# EasyEDA Pro project 2025新M0板子工程.eprj, board PCB2
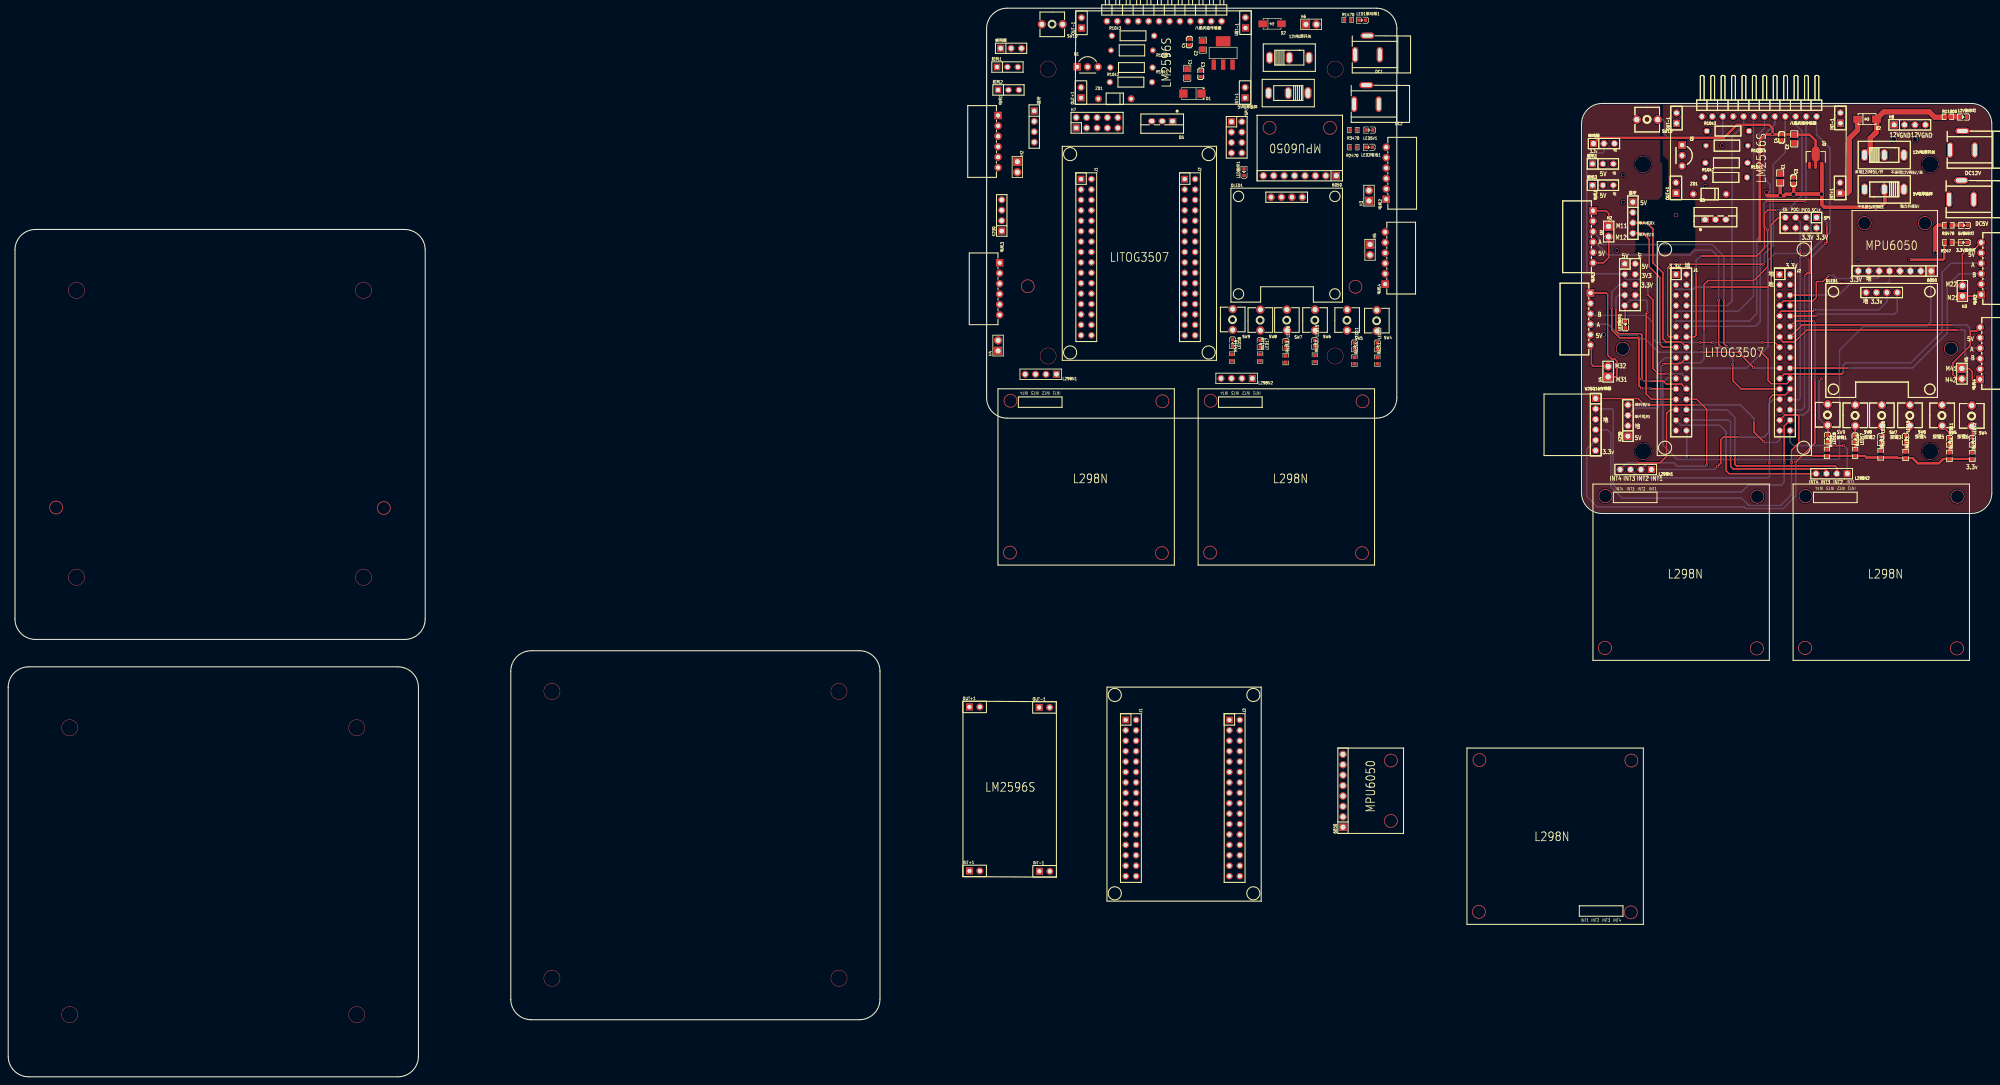
[diagram p3: board, top side]
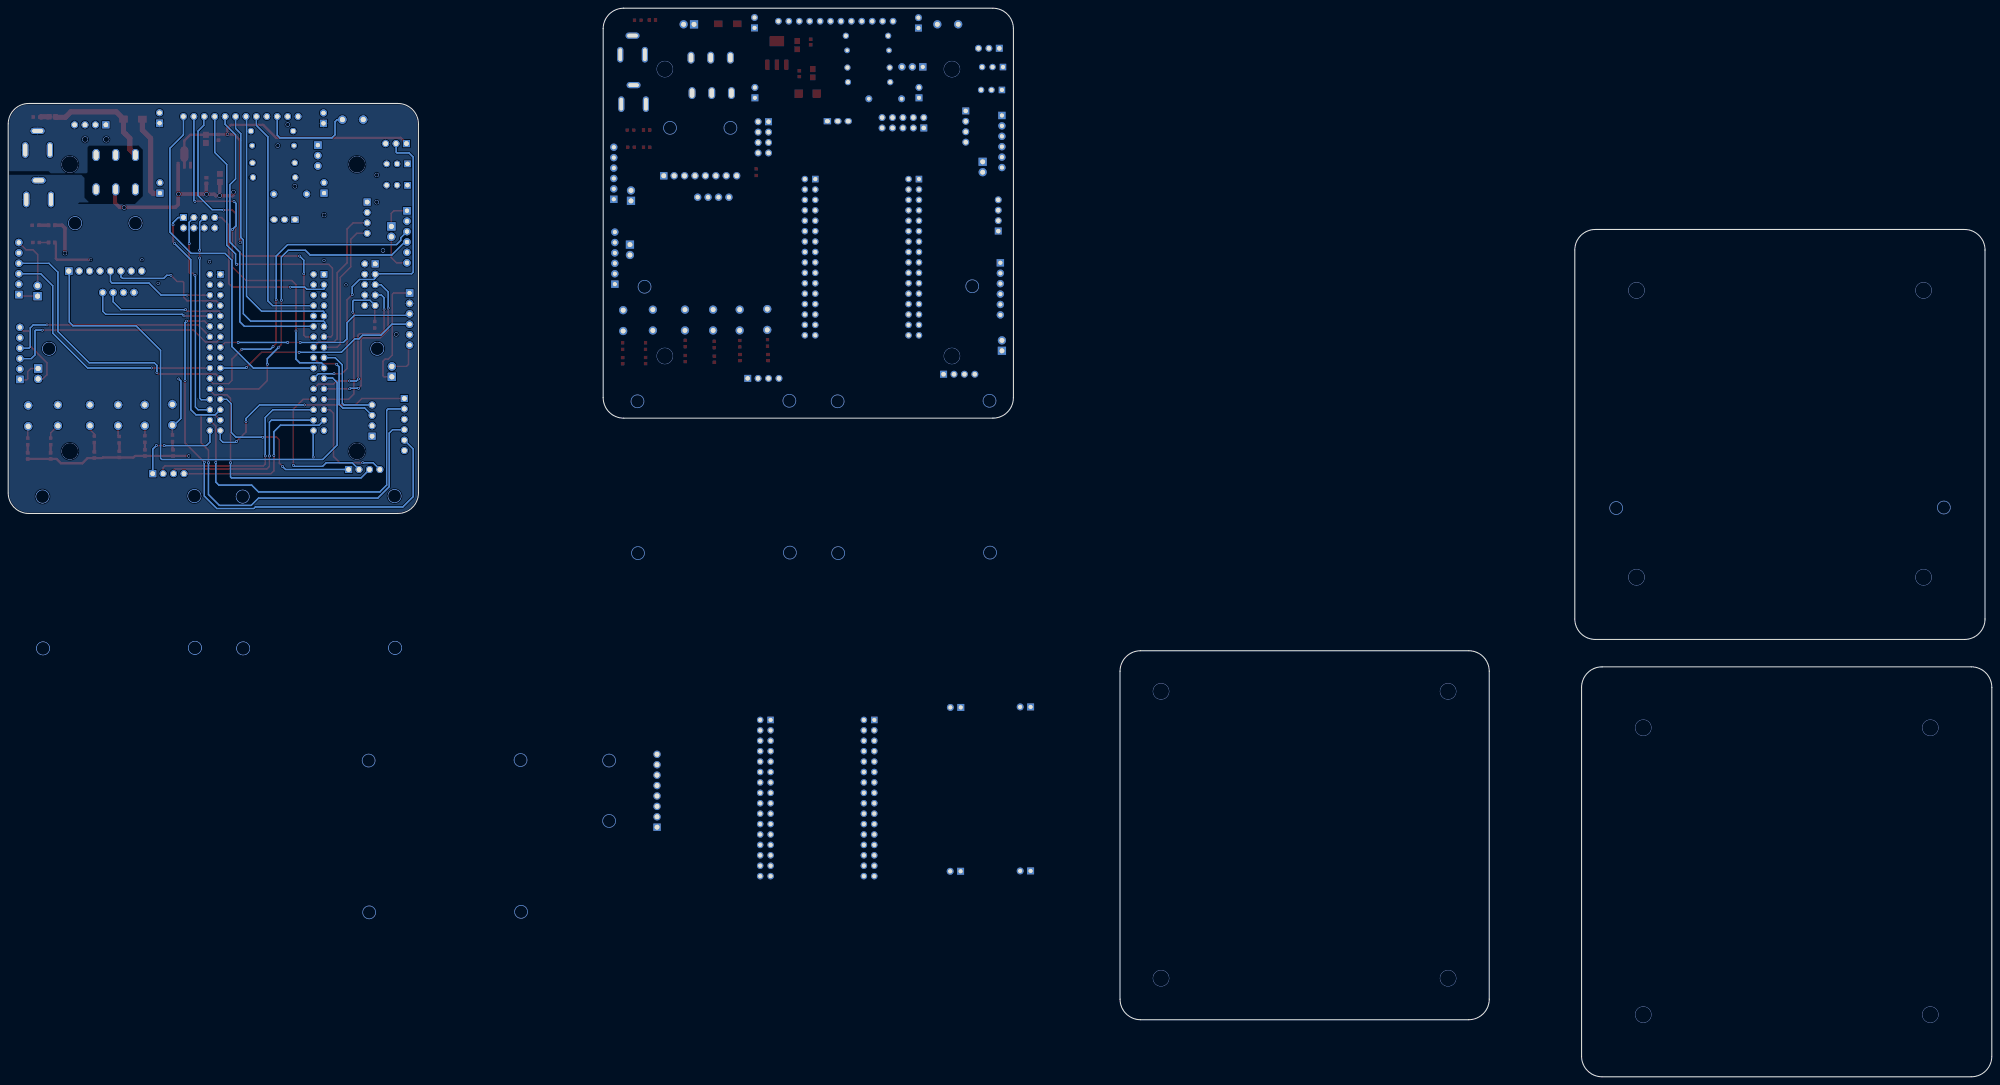
[diagram p4: board, bottom side, seen from below]

Outline 483.54 x 260.66 mm; copper layers: Top Layer, Inner1, Inner2, Bottom Layer. Coordinates in mm from the lower left corner of the outline.
Outline path: 0,95 0,5 arc(1.46,1.46) 5,0 95,0 arc(98.54,1.46) 100,5 100,95 arc(98.54,98.54) 95,100 5,100 arc(1.46,98.54) 0,95 ; 1.65,201.68 1.65,111.68 arc(3.12,108.14) 6.65,106.68 96.65,106.68 arc(100.19,108.14) 101.65,111.68 101.65,201.68 arc(100.19,205.22) 96.65,206.68 6.65,206.68 arc(3.12,205.22) 1.65,201.68 ; 122.51,98.92 122.51,18.92 arc(123.97,15.39) 127.51,13.92 207.51,13.92 arc(211.05,15.39) 212.51,18.92 212.51,98.92 arc(211.05,102.46) 207.51,103.92 127.51,103.92 arc(123.97,102.46) 122.51,98.92 ; 238.51,255.66 238.51,165.66 arc(239.97,162.12) 243.51,160.66 333.51,160.66 arc(337.04,162.12) 338.51,165.66 338.51,255.66 arc(337.04,259.19) 333.51,260.66 243.51,260.66 arc(239.97,259.19) 238.51,255.66 ; 383.54,232.41 383.54,142.41 arc(385,138.88) 388.54,137.41 478.54,137.41 arc(482.08,138.88) 483.54,142.41 483.54,232.41 arc(482.08,235.95) 478.54,237.41 388.54,237.41 arc(385,235.95) 383.54,232.41
Stack: Top Layer 0.035mm / Dielectric1 1.51mm FR4 er 4.5 / Inner1 0.035mm / Dielectric2 0.48mm PP er 4.5 / Inner2 0.035mm / Dielectric3 0.48mm PP er 4.5 / Bottom Layer 0.035mm

## Design rules (mm)
template: JLCPCB Capability(Two Layers Board)
spacing copperThickness1oz (default): track to track 0.102, other pairs 0.152 to 0.3
spacing copperThickness2oz: track to track 0.203, other pairs 0.152 to 0.3
track width copperThickness1oz (default): min 0.127, default 0.254, max 2.54
track width copperThickness2oz: min 0.203, default 0.254, max 2.54
differential pair differentialPair (default): width min 0.127, default 0.254, max 2.54; gap min 0.152, default 0.152
via viaSize (default): diameter min 0.5, default 0.61, max 10; hole min 0.3, default 0.305, max 6.3

## Placement (name value [footprint] x y rotation side)
3.3V指示灯  -  [LED0603-RD-YELLOW]  476.76 203.51 180 top
3.3V指示灯#2  -  [LED0603-RD-YELLOW]  476.76 203.51 180 top
5V指示灯  -  [LED0603-RD-YELLOW]  476.88 207.7 180 top
5V指示灯#2  -  [LED0603-RD-YELLOW]  476.88 207.7 180 top
5V电源选择  -  [SW-TH_SHOU-HAN_SS12D10G4]  312.04 239.95 180 top
5V电源选择#2  -  [SW-TH_SHOU-HAN_SS12D10G4]  457.33 216.46 180 top
5V电源选择#3  -  [SW-TH_SHOU-HAN_SS12D10G4]  457.33 216.46 180 top
12V指示灯  -  [LED0603-RD-YELLOW]  476.63 234.11 180 top
12V指示灯#2  -  [LED0603-RD-YELLOW]  476.63 234.11 180 top
12V电源开关  -  [SW-TH_SHOU-HAN_SS12D10G4]  312.29 248.59 0 top
12V电源开关#2  -  [SW-TH_SHOU-HAN_SS12D10G4]  457.33 224.84 0 top
12V电源开关#3  -  [SW-TH_SHOU-HAN_SS12D10G4]  457.33 224.84 0 top
6050  -  [HDR-TH_8P-P2.54-V-F-1]  459.88 196.54 180 top
6050#2  -  [HDR-TH_8P-P2.54-V-F-1]  314.85 219.79 180 top
6050#3  -  [HDR-TH_8P-P2.54-V-F-1]  459.88 196.54 180 top
6050#4  -  [HDR-TH_8P-P2.54-V-F-1]  325.37 69.77 90 top
C1  -  [C0805]  287.4 244.78 270 top
C1#2  -  [C0805]  431.93 219.25 270 top
C1#3  -  [C0805]  431.93 219.25 270 top
C2  -  [C0805]  291.21 251.64 90 top
C2#2  -  [C0805]  435.36 228.78 90 top
C2#3  -  [C0805]  435.36 228.78 90 top
C3  -  [C0603]  290.7 244.65 270 top
C3#2  -  [C0603]  435.23 218.62 270 top
C3#3  -  [C0603]  435.23 218.62 270 top
C4  -  [C0603]  287.91 252.4 90 top
C4#2  -  [C0603]  432.31 229.16 90 top
C4#3  -  [C0603]  432.31 229.16 90 top
D1  SS34  [SMA_L4.3-W2.6-LS5.2-RD]  288.67 239.83 180 top
D2  -  [SMA_L4.3-W2.6-LS5.0-FD]  308.1 256.85 180 top
D2#2  -  [SMA_L4.3-W2.6-LS5.0-FD]  453.14 233.6 180 top
D2#3  -  [SMA_L4.3-W2.6-LS5.0-FD]  453.14 233.6 180 top
DC1  DC005-T25  [DC-IN-TH_DC-005-20A-1]  331.34 251.64 180 top
DC2  DC005-T25  [DC-IN-TH_DC-005-20A-1]  331.09 239.57 180 top
DC5V  -  [DC-IN-TH_DC-005-20A-1]  476.12 216.33 180 top
DC5V#2  -  [DC-IN-TH_DC-005-20A-1]  476.12 216.33 180 top
DC12V  -  [DC-IN-TH_DC-005-20A-1]  476.38 228.4 180 top
DC12V#2  -  [DC-IN-TH_DC-005-20A-1]  476.38 228.4 180 top
H2  -  [HDR-TH_2P-P2.54-V-M]  246 221.92 270 top
H2#2  -  [HDR-TH_2P-P2.54-V-M]  390.14 206.17 270 top
H2#3  -  [HDR-TH_2P-P2.54-V-M]  390.14 206.17 270 top
H3  -  [HDR-TH_2P-P2.54-V-M]  331.72 214.94 90 top
H3#2  -  [HDR-TH_2P-P2.54-V-M]  476.38 191.69 90 top
H3#3  -  [HDR-TH_2P-P2.54-V-M]  476.38 191.69 90 top
H4  -  [HDR-TH_2P-P2.54-V-M]  241.3 178.36 90 top
H4#2  -  [HDR-TH_2P-P2.54-V-M]  390.02 172.01 90 top
H4#3  -  [HDR-TH_2P-P2.54-V-M]  390.02 172.01 90 top
H5  -  [HDR-TH_2P-P2.54-V-M]  331.98 201.73 270 top
H5#2  -  [HDR-TH_2P-P2.54-V-M]  476.25 171.5 270 top
H5#3  -  [HDR-TH_2P-P2.54-V-M]  476.25 171.5 270 top
H6  PZ254V-11-02P  [HDR-TH_2P-P2.54-V-M]  317.63 256.72 0 top
H7  -  [HDR-TH_10P-P2.54-V-M-R2-C5-S2.54]  265.43 232.72 0 top
H7#2  -  [HDR-TH_10P-P2.54-V-M-R2-C5-S2.54]  395.35 193.22 270 top
H7#3  -  [HDR-TH_10P-P2.54-V-M-R2-C5-S2.54]  395.35 193.22 270 top
H8  -  [HDR-TH_4P-P2.54-V-M]  463.55 232.21 0 top
H8#2  -  [HDR-TH_4P-P2.54-V-M]  463.55 232.21 0 top
INT+1  -  [HDR-TH_2P-P2.54-V-F]  446.56 216.82 90 top
INT+1#2  -  [HDR-TH_2P-P2.54-V-F]  301.52 240.06 90 top
INT+1#3  -  [HDR-TH_2P-P2.54-V-F]  235.59 50.22 0 top
INT+1#4  -  [HDR-TH_2P-P2.54-V-F]  446.56 216.82 90 top
INT-1  -  [HDR-TH_2P-P2.54-V-F]  301.61 257.12 90 top
INT-1#2  -  [HDR-TH_2P-P2.54-V-F]  252.65 50.13 0 top
INT-1#3  -  [HDR-TH_2P-P2.54-V-F]  446.64 233.88 90 top
INT-1#4  -  [HDR-TH_2P-P2.54-V-F]  446.64 233.88 90 top
J1  -  [HDR-TH_32P-P2.54-V-F-R2-C16-S2.54]  262.8 199.92 270 top
J1#2  -  [HDR-TH_32P-P2.54-V-F-R2-C16-S2.54]  273.69 68 270 top
J1#3  -  [HDR-TH_32P-P2.54-V-F-R2-C16-S2.54]  407.83 176.68 270 top
J1#4  -  [HDR-TH_32P-P2.54-V-F-R2-C16-S2.54]  407.83 176.68 270 top
J2  -  [HDR-TH_32P-P2.54-V-F-R2-C16-S2.54]  288.07 199.92 270 top
J2#2  -  [HDR-TH_32P-P2.54-V-F-R2-C16-S2.54]  298.96 68 270 top
J2#3  -  [HDR-TH_32P-P2.54-V-F-R2-C16-S2.54]  433.1 176.68 270 top
J2#4  -  [HDR-TH_32P-P2.54-V-F-R2-C16-S2.54]  433.1 176.68 270 top
K230  -  [HDR-TH_4P-P2.54-V-M]  242.19 210.11 90 top
K230#2  -  [HDR-TH_4P-P2.54-V-M]  394.84 160.07 90 top
K230#3  -  [HDR-TH_4P-P2.54-V-M]  394.84 160.07 90 top
L298N1  -  [HDR-TH_4P-P2.54-V-M-1]  251.71 171.37 180 top
L298N1#2  -  [HDR-TH_4P-P2.54-V-M-1]  396.75 148.13 180 top
L298N1#3  -  [HDR-TH_4P-P2.54-V-M-1]  396.75 148.13 180 top
L298N2  -  [HDR-TH_4P-P2.54-V-M-1]  299.47 170.36 180 top
L298N2#2  -  [HDR-TH_4P-P2.54-V-M-1]  444.5 147.12 180 top
L298N2#3  -  [HDR-TH_4P-P2.54-V-M-1]  444.5 147.12 180 top
LED1驱动板1  LTST-C191KSKT  [LED0603-RD-YELLOW]  330.07 257.73 180 top
LED2电池1  LTST-C191KSKT  [LED0603-RD-YELLOW]  331.72 226.75 180 top
LED5V1  LTST-C191KSKT  [LED0603-RD-YELLOW]  331.85 230.94 180 top
LED11  -  [LED0603-RD-YELLOW]  328.17 178.23 270 top
LED11#2  -  [LED0603-RD-YELLOW]  473.2 154.99 270 top
LED11#3  -  [LED0603-RD-YELLOW]  473.2 154.99 270 top
LED12  -  [LED0603-RD-YELLOW]  333.76 178.23 270 top
LED12#2  -  [LED0603-RD-YELLOW]  478.79 154.99 270 top
LED12#3  -  [LED0603-RD-YELLOW]  478.79 154.99 270 top
LED15  -  [LED0603-RD-YELLOW]  318.52 178.87 270 top
LED15#2  -  [LED0603-RD-YELLOW]  462.53 155.5 270 top
LED15#3  -  [LED0603-RD-YELLOW]  462.53 155.5 270 top
LED16  -  [LED0603-RD-YELLOW]  311.45 178.63 270 top
LED16#2  -  [LED0603-RD-YELLOW]  456.49 155.39 270 top
LED16#3  -  [LED0603-RD-YELLOW]  456.49 155.39 270 top
LED17  -  [LED0603-RD-YELLOW]  305.2 178.82 270 top
LED17#2  -  [LED0603-RD-YELLOW]  450.23 155.58 270 top
LED17#3  -  [LED0603-RD-YELLOW]  450.23 155.58 270 top
LED18  -  [LED0603-RD-YELLOW]  298.45 178.99 270 top
LED18#2  -  [LED0603-RD-YELLOW]  443.48 155.75 270 top
LED18#3  -  [LED0603-RD-YELLOW]  443.48 155.75 270 top
LED指示1  -  [LED0603-RD-YELLOW]  301.24 220.65 90 top
LED指示1#2  -  [LED0603-RD-YELLOW]  394.21 183.44 90 top
LED指示1#3  -  [LED0603-RD-YELLOW]  394.21 183.44 90 top
OLED1  -  [OLED-TH_L27.8-W27.2-P2.54_C9900033791]  311.66 214.55 0 top
OLED1#2  -  [OLED-TH_L27.8-W27.2-P2.54_C9900033791]  456.69 191.31 0 top
OLED1#3  -  [OLED-TH_L27.8-W27.2-P2.54_C9900033791]  456.69 191.31 0 top
OUT+1  -  [HDR-TH_2P-P2.54-V-F]  261.52 240.06 90 top
OUT+1#2  -  [HDR-TH_2P-P2.54-V-F]  235.59 90.22 0 top
OUT+1#3  -  [HDR-TH_2P-P2.54-V-F]  406.55 216.82 90 top
OUT+1#4  -  [HDR-TH_2P-P2.54-V-F]  406.55 216.82 90 top
OUT-1  -  [HDR-TH_2P-P2.54-V-F]  261.64 257.08 90 top
OUT-1#2  -  [HDR-TH_2P-P2.54-V-F]  252.6 90.09 0 top
OUT-1#3  -  [HDR-TH_2P-P2.54-V-F]  406.68 233.84 90 top
OUT-1#4  -  [HDR-TH_2P-P2.54-V-F]  406.68 233.84 90 top
Q1  -  [TO-92-3_L4.8-W3.7-P2.54-L]  263.13 246.34 0 top
Q1#2  -  [TO-92-3_L4.8-W3.7-P2.54-L]  408.05 224.71 270 top
Q1#3  -  [TO-92-3_L4.8-W3.7-P2.54-L]  408.05 224.71 270 top
Q5  -  [TO-220-3_L10.2-W4.5-P2.54-L-1]  281.31 233.1 180 top
Q5#2  -  [TO-220-3_L10.2-W4.5-P2.54-L-1]  416.18 209.09 0 top
Q5#3  -  [TO-220-3_L10.2-W4.5-P2.54-L-1]  416.18 209.09 0 top
Q7  -  [SOT-89-3_L4.5-W2.5-P1.50-LS4.2-BR]  440.61 223.73 270 top
Q7#2  -  [SOT-89-3_L4.5-W2.5-P1.50-LS4.2-BR]  440.61 223.73 270 top
R10k1  -  [RES-TH_BD2.4-L6.3-P10.30-D0.6]  273.81 246.18 180 top
R10k1#2  -  [RES-TH_BD2.4-L6.3-P10.30-D0.6]  418.85 222.94 180 top
R10k1#3  -  [RES-TH_BD2.4-L6.3-P10.30-D0.6]  418.85 222.94 180 top
R10k2  -  [RES-TH_BD2.4-L6.3-P10.30-D0.6]  273.69 242.62 0 top
R10k2#2  -  [RES-TH_BD2.4-L6.3-P10.30-D0.6]  418.72 219.38 0 top
R10k2#3  -  [RES-TH_BD2.4-L6.3-P10.30-D0.6]  418.72 219.38 0 top
R10k3  -  [RES-TH_BD2.4-L6.3-P10.30-D0.6]  274.19 253.92 0 top
R10k3#2  -  [RES-TH_BD2.4-L6.3-P10.30-D0.6]  419.23 230.68 0 top
R10k3#3  -  [RES-TH_BD2.4-L6.3-P10.30-D0.6]  419.23 230.68 0 top
R41k1  -  [R0603#2]  333.76 174.68 270 top
R41k1#2  -  [R0603#2]  478.79 151.44 270 top
R41k1#3  -  [R0603#2]  478.79 151.44 270 top
R41k2  -  [R0603#2]  318.52 175.18 270 top
R41k2#2  -  [R0603#2]  462.53 151.69 270 top
R41k2#3  -  [R0603#2]  462.53 151.69 270 top
R41k3  -  [R0603#2]  311.4 175.06 270 top
R41k3#2  -  [R0603#2]  456.44 151.82 270 top
R41k3#3  -  [R0603#2]  456.44 151.82 270 top
R41k4  -  [R0603#2]  328.17 174.71 270 top
R41k4#2  -  [R0603#2]  473.21 151.47 270 top
R41k4#3  -  [R0603#2]  473.21 151.47 270 top
R41k5  -  [R0603#2]  305.18 175.44 270 top
R41k5#2  -  [R0603#2]  450.22 152.2 270 top
R41k5#3  -  [R0603#2]  450.22 152.2 270 top
R41k6  -  [R0603#2]  298.32 175.44 270 top
R41k6#2  -  [R0603#2]  443.36 152.2 270 top
R41k6#3  -  [R0603#2]  443.36 152.2 270 top
R100k1  -  [RES-TH_BD2.7-L6.2-P10.20-D0.4]  273.94 250.37 180 top
R100k1#2  -  [RES-TH_BD2.7-L6.2-P10.20-D0.4]  418.97 227.13 180 top
R100k1#3  -  [RES-TH_BD2.7-L6.2-P10.20-D0.4]  418.97 227.13 180 top
R247  -  [R0603#2]  472.95 203.51 0 top
R247#2  -  [R0603#2]  472.95 203.51 0 top
R1470  470Ω  [R0603#2]  326.51 257.79 0 top
R2470  470Ω  [R0603#2]  327.91 226.75 0 top
R3470  -  [R0603#2]  327.91 230.94 0 top
R3470#2  -  [R0603#2]  472.95 207.7 0 top
R3470#3  -  [R0603#2]  472.95 207.7 0 top
R11000  -  [R0603]  472.82 234.17 0 top
R11000#2  -  [R0603]  472.82 234.17 0 top
SPI  -  [HDR-TH_8P-P2.54-V-M-R2-C4-S2.54]  299.47 229.16 270 top
SPI#2  -  [HDR-TH_8P-P2.54-V-M-R2-C4-S2.54]  437.01 208.33 180 top
SPI#3  -  [HDR-TH_8P-P2.54-V-M-R2-C4-S2.54]  437.01 208.33 180 top
SW4  -  [KEY-TH_2P-L6.0-W6.0-P5.00]  333.63 184.46 270 top
SW4#2  -  [KEY-TH_2P-L6.0-W6.0-P5.00]  478.66 161.21 270 top
SW4#3  -  [KEY-TH_2P-L6.0-W6.0-P5.00]  478.66 161.21 270 top
SW5  -  [KEY-TH_2P-L6.0-W6.0-P5.00]  326.39 184.58 270 top
SW5#2  -  [KEY-TH_2P-L6.0-W6.0-P5.00]  471.42 161.34 270 top
SW5#3  -  [KEY-TH_2P-L6.0-W6.0-P5.00]  471.42 161.34 270 top
SW6  -  [KEY-TH_2P-L6.0-W6.0-P5.00]  318.56 184.6 270 top
SW6#2  -  [KEY-TH_2P-L6.0-W6.0-P5.00]  463.6 161.36 270 top
SW6#3  -  [KEY-TH_2P-L6.0-W6.0-P5.00]  463.6 161.36 270 top
SW7  -  [KEY-TH_2P-L6.0-W6.0-P5.00]  311.71 184.6 270 top
SW7#2  -  [KEY-TH_2P-L6.0-W6.0-P5.00]  456.74 161.36 270 top
SW7#3  -  [KEY-TH_2P-L6.0-W6.0-P5.00]  456.74 161.36 270 top
SW8  -  [KEY-TH_2P-L6.0-W6.0-P5.00]  305.23 184.6 270 top
SW8#2  -  [KEY-TH_2P-L6.0-W6.0-P5.00]  450.26 161.36 270 top
SW8#3  -  [KEY-TH_2P-L6.0-W6.0-P5.00]  450.26 161.36 270 top
SW9  K2-1104DZ-G4SW-04  [KEY-TH_2P-L6.0-W6.0-P5.00]  298.5 184.72 270 top
SW10  -  [KEY-TH_2P-L6.0-W6.0-P5.00]  254.51 256.72 180 top
SW10#2  -  [KEY-TH_2P-L6.0-W6.0-P5.00]  399.54 233.48 180 top
SW10#3  -  [KEY-TH_2P-L6.0-W6.0-P5.00]  399.54 233.48 180 top
U1  BL9110-330BPFB  [SOT-223_L6.5-W3.5-P2.30-LS7.0-BR]  296.16 249.73 270 top
W25Q16存储器  -  [HDR-TH_6P-P2.54-V-M]  386.97 159.1 270 top
W25Q16存储器#2  -  [HDR-TH_6P-P2.54-V-M]  386.97 159.1 270 top
ZD1  -  [DO-41_BD2.8-L4.2-P8.00-D0.7-FD]  269.75 238.56 0 top
ZD1#2  -  [DO-41_BD2.8-L4.2-P8.00-D0.7-FD]  414.78 215.32 0 top
ZD1#3  -  [DO-41_BD2.8-L4.2-P8.00-D0.7-FD]  414.78 215.32 0 top
八路灰度传感器  -  [HDR-TH_12P-P2.54-H-M-W10.5]  281.81 257.48 180 top
八路灰度传感器#2  -  [HDR-TH_12P-P2.54-H-M-W10.5]  426.85 234.24 180 top
八路灰度传感器#3  -  [HDR-TH_12P-P2.54-H-M-W10.5]  426.85 234.24 180 top
按键1  -  [KEY-TH_2P-L6.0-W6.0-P5.00]  443.53 161.48 270 top
按键1#2  -  [KEY-TH_2P-L6.0-W6.0-P5.00]  443.53 161.48 270 top
电机1  -  [CONN-TH_6P-P2.54_HCTL_XH-6AW_C2908615]  241.3 228.14 270 top
电机1#2  -  [CONN-TH_6P-P2.54_HCTL_XH-6AW_C2908615]  386.33 204.9 270 top
电机1#3  -  [CONN-TH_6P-P2.54_HCTL_XH-6AW_C2908615]  386.33 204.9 270 top
电机2  -  [CONN-TH_6P-P2.54_HCTL_XH-6AW_C2908615]  335.91 220.4 90 top
电机2#2  -  [CONN-TH_6P-P2.54_HCTL_XH-6AW_C2908615]  480.95 197.16 90 top
电机2#3  -  [CONN-TH_6P-P2.54_HCTL_XH-6AW_C2908615]  480.95 197.16 90 top
电机3  -  [CONN-TH_6P-P2.54_HCTL_XH-6AW_C2908615]  241.68 192.2 270 top
电机3#2  -  [CONN-TH_6P-P2.54_HCTL_XH-6AW_C2908615]  385.7 184.84 270 top
电机3#3  -  [CONN-TH_6P-P2.54_HCTL_XH-6AW_C2908615]  385.7 184.84 270 top
电机4  -  [CONN-TH_6P-P2.54_HCTL_XH-6AW_C2908615]  335.66 199.7 90 top
电机4#2  -  [CONN-TH_6P-P2.54_HCTL_XH-6AW_C2908615]  480.7 176.45 90 top
电机4#3  -  [CONN-TH_6P-P2.54_HCTL_XH-6AW_C2908615]  480.7 176.45 90 top
舵机1  -  [HDR-TH_3P-P2.54-V-F]  243.59 246.3 0 top
舵机1#2  -  [HDR-TH_3P-P2.54-V-F]  388.75 222.68 0 top
舵机1#3  -  [HDR-TH_3P-P2.54-V-F]  388.75 222.68 0 top
舵机2  -  [HDR-TH_3P-P2.54-V-F]  243.84 240.72 0 top
舵机2#2  -  [HDR-TH_3P-P2.54-V-F]  388.75 217.48 0 top
舵机2#3  -  [HDR-TH_3P-P2.54-V-F]  388.75 217.48 0 top
蓝牙  -  [HDR-TH_4P-P2.54-V-F]  250.12 231.79 270 top
蓝牙#2  -  [HDR-TH_4P-P2.54-V-F]  396.04 209.56 270 top
蓝牙#3  -  [HDR-TH_4P-P2.54-V-F]  396.04 209.56 270 top
蜂鸣器  -  [HDR-TH_3P-P2.54-V-M]  244.47 250.88 0 top
蜂鸣器#2  -  [HDR-TH_3P-P2.54-V-M]  389 227.64 0 top
蜂鸣器#3  -  [HDR-TH_3P-P2.54-V-M]  389 227.64 0 top

## Footprints (pads in the part's own frame, mm; a bottom-side part is the same pattern mirrored in y, then rotated)
C0603
  rect 0.8x0.9 smd: 1(-0.7,0) 2(0.7,0)
C0805
  rect 1.41x1.35 smd: 1(-1,0) 2(1,0)
CONN-TH_6P-P2.54_HCTL_XH-6AW_C2908615
  rect 1.8x1.8 hole 1: 1(-6.35,0)
  round 1.8 hole 1: 2(-3.81,0) 3(-1.27,0) 4(1.27,0) 5(3.81,0) 6(6.35,0)
DC-IN-TH_DC-005-20A-1
  oval 1.5x3.8 hole 0.9x3.1: 1(3,2.325) 2(-3,2.325)
  oval 3.4x1.5 hole 2.6x0.9: 3(0,-2.325)
DO-41_BD2.8-L4.2-P8.00-D0.7-FD
  round 1.7 hole 0.9: 1(-4,0) 2(4,0)
HDR-TH_2P-P2.54-V-F
  rect 1.7x1.7 hole 1: 1(-1.27,0)
  round 1.7 hole 1: 2(1.27,0)
HDR-TH_2P-P2.54-V-M
  rect 2x2 hole 1.2: 1(-1.27,0)
  round 2 hole 1.2: 2(1.27,0)
HDR-TH_3P-P2.54-V-F
  rect 1.575x1.575 hole 1.02: 1(-2.54,0)
  round 1.575 hole 1.02: 2(0,0) 3(2.54,0)
HDR-TH_3P-P2.54-V-M
  rect 1.7x1.7 hole 1.1: 1(-2.54,0)
  round 1.7 hole 1.1: 2(0,0) 3(2.54,0)
HDR-TH_4P-P2.54-V-F
  rect 1.7x1.7 hole 1.1: 1(-3.81,0)
  round 1.7 hole 1.1: 2(-1.27,0) 3(1.27,0) 4(3.81,0)
HDR-TH_4P-P2.54-V-M
  rect 1.7x1.7 hole 1.1: 1(-3.81,0)
  round 1.7 hole 1.1: 2(-1.27,0) 3(1.27,0) 4(3.81,0)
HDR-TH_4P-P2.54-V-M-1
  rect 1.7x1.7 hole 1.1: 1(-3.81,0)
  round 1.7 hole 1.1: 2(-1.27,0) 3(1.27,0) 4(3.81,0)
HDR-TH_6P-P2.54-V-M
  rect 1.7x1.7 hole 1.1: 1(-6.35,0)
  round 1.7 hole 1.1: 2(-3.81,0) 3(-1.27,0) 4(1.27,0) 5(3.81,0) 6(6.35,0)
HDR-TH_8P-P2.54-V-F-1
  rect 1.8x1.8 hole 1.2: 1(-8.89,0)
  round 1.8 hole 1.2: 2(-6.35,0) 3(-3.81,0) 4(-1.27,0) 5(1.27,0) 6(3.81,0) 7(6.35,0) 8(8.89,0)
HDR-TH_8P-P2.54-V-M-R2-C4-S2.54
  rect 1.7x1.7 hole 1.1: 1(-3.81,-1.27)
  round 1.7 hole 1.1: 2(-3.81,1.27) 3(-1.27,-1.27) 4(-1.27,1.27) 5(1.27,-1.27) 6(1.27,1.27) 7(3.81,-1.27) 8(3.81,1.27)
HDR-TH_10P-P2.54-V-M-R2-C5-S2.54
  rect 1.7x1.7 hole 1.1: 1(-5.08,-1.27)
  round 1.7 hole 1.1: 2(-5.08,1.27) 3(-2.54,-1.27) 4(-2.54,1.27) 5(0,-1.27) 6(0,1.27) 7(2.54,-1.27) 8(2.54,1.27) 9(5.08,-1.27) 10(5.08,1.27)
HDR-TH_12P-P2.54-H-M-W10.5
  round 1.65 hole 1.02: 1(-13.97,0) 2(-11.43,0) 3(-8.89,0) 4(-6.35,0) 5(-3.81,0) 6(-1.27,0) 7(1.27,0) 8(3.81,0) 9(6.35,0) 10(8.89,0) 11(11.43,0) 12(13.97,0)
HDR-TH_32P-P2.54-V-F-R2-C16-S2.54
  rect 1.6x1.6 hole 1: 1(-19.05,-1.27)
  round 1.6 hole 1: 2(-19.05,1.27) 3(-16.51,-1.27) 4(-16.51,1.27) 5(-13.97,-1.27) 6(-13.97,1.27) 7(-11.43,-1.27) 8(-11.43,1.27) 9(-8.89,-1.27) 10(-8.89,1.27) 11(-6.35,-1.27) 12(-6.35,1.27) 13(-3.81,-1.27) 14(-3.81,1.27) 15(-1.27,-1.27) 16(-1.27,1.27) 17(1.27,-1.27) 18(1.27,1.27) 19(3.81,-1.27) 20(3.81,1.27) 21(6.35,-1.27) 22(6.35,1.27) 23(8.89,-1.27) 24(8.89,1.27) 25(11.43,-1.27) 26(11.43,1.27) 27(13.97,-1.27) 28(13.97,1.27) 29(16.51,-1.27) 30(16.51,1.27) 31(19.05,-1.27) 32(19.05,1.27)
KEY-TH_2P-L6.0-W6.0-P5.00
  round 2 hole 1.2: 1(-2.54,0) 2(2.54,0)
LED0603-RD-YELLOW
  rect 0.8x0.8 smd: 1(-0.799,-0.004) 2(0.799,0.004)
OLED-TH_L27.8-W27.2-P2.54_C9900033791
  round 1.8 hole 1.05: 1(-3.81,0) 2(-1.27,0) 3(1.27,0) 4(3.81,0)
R0603
  rect 1.2x1.2 smd: 1(-0.753,0) 2(0.753,0)
R0603#2
  rect 0.806x0.864 smd: 1(-0.753,0) 2(0.753,0)
RES-TH_BD2.4-L6.3-P10.30-D0.6
  round 1.524 hole 1: 1(-5.15,0) 2(5.15,0)
RES-TH_BD2.7-L6.2-P10.20-D0.4
  round 1.4 hole 0.8: 1(-5.1,0) 2(5.1,0)
SMA_L4.3-W2.6-LS5.0-FD
  rect 2.046x1.62 smd: 1(-2.304,-0.009) 2(2.304,0.009)
SMA_L4.3-W2.6-LS5.2-RD
  rect 2x2 smd: 1(-2.2,0) 2(2.2,0)
SOT-89-3_L4.5-W2.5-P1.50-LS4.2-BR
  rect 1.575x0.672 smd: 1(1.356,-1.5) 3(1.356,1.5)
  custom 5.377x1.9 smd: 2(-1.356,0)
SOT-223_L6.5-W3.5-P2.30-LS7.0-BR
  rect 2.465x1.05 smd: 1(2.857,-2.3) 2(2.857,0) 3(2.857,2.3)
  rect 2.465x3.54 smd: 4(-2.857,0)
SW-TH_SHOU-HAN_SS12D10G4
  oval 1.7x2.9 hole 1.1x2.3: 1(-4.8,0) 2(0,0) 3(4.8,0)
TO-92-3_L4.8-W3.7-P2.54-L
  rect 1.8x1.8 hole 1: 1(-2.54,0)
  round 1.8 hole 1: 2(0,0) 3(2.54,0)
TO-220-3_L10.2-W4.5-P2.54-L-1
  rect 1.8x1.5 hole 1.2x1: 1(-2.54,0)
  oval 1.8x1.5 hole 1.2x1: 2(0,0) 3(2.54,0)

## Nets
3.3V: 6050#2.8 6050#4.8 R41k1.2 R41k2.2 R41k3.2 R41k4.2 R41k5.2 R41k6.2
3V3: 6050.8 6050#3.8 C2.2 C2#2.2 C2#3.2 C4.2 C4#2.2 C4#3.2 H7.6 H7#2.4 H7#2.6 H7#3.4 H7#3.6 J1.1 J1#2.1 J1#3.1 J1#4.1 J2.2 J2#2.2 J2#3.2 J2#4.2 OLED1.2 OLED1#2.2 OLED1#3.2 Q7.2 Q7#2.2 R41k1#2.2 R41k1#3.2 R41k2#2.2 R41k2#3.2 R41k3#2.2 R41k3#3.2 R41k4#2.2 R41k4#3.2 R41k5#2.2 R41k5#3.2 R41k6#2.2 R41k6#3.2 R247.1 R247#2.1 R2470.1 SPI#2.2 SPI#2.4 SPI#3.2 SPI#3.4 U1.2 U1.4 W25Q16存储器.6 W25Q16存储器#2.6 蜂鸣器.1 蜂鸣器#2.1 蜂鸣器#3.1
5V: 5V电源选择.2 5V电源选择#2.2 5V电源选择#3.2 C1#2.2 C1#3.2 C3#2.2 C3#3.2 D1.2 H7.2 H7.4 H7#2.1 H7#2.2 H7#3.1 H7#3.2 K230.1 K230#2.1 K230#3.1 Q5.2 Q7.3 Q7#2.3 R3470.1 R3470#2.1 R3470#3.1 八路灰度传感器.11 八路灰度传感器#2.11 八路灰度传感器#3.11 电机1.5 电机1#2.5 电机1#3.5 电机2.5 电机2#2.5 电机2#3.5 电机3.5 电机3#2.5 电机3#3.5 电机4.5 电机4#2.5 电机4#3.5 舵机1.2 舵机1#2.2 舵机1#3.2 舵机2.2 舵机2#2.2 舵机2#3.2 蓝牙.1 蓝牙#2.1 蓝牙#3.1
5V1: 5V电源选择.1 5V电源选择#2.1 5V电源选择#3.1 DC2.1 DC5V.1 DC5V#2.1
5V2: OUT+1.1 OUT+1#2.1 OUT+1#3.1 OUT+1#4.1 Q1.1 Q1#2.1 Q1#3.1 Q5.3 Q5#2.3 Q5#3.3 R10k1.2 R10k1#2.2 R10k1#3.2 R100k1.2 R100k1#2.2 R100k1#3.2
5V3: 5V电源选择#2.3 5V电源选择#3.3 Q5#2.2 Q5#3.2
12V: 12V电源开关.1 12V电源开关#2.1 12V电源开关#3.1 D2.1 D2#2.1 D2#3.1 R1470.1 R11000.1 R11000#2.1
GND: 3.3V指示灯.1 3.3V指示灯#2.1 5V指示灯.1 5V指示灯#2.1 12V指示灯.1 12V指示灯#2.1 6050.7 6050#2.7 6050#3.7 6050#4.7 C1.1 C1#2.1 C1#3.1 C2.1 C2#2.1 C2#3.1 C3.1 C3#2.1 C3#3.1 C4.1 C4#2.1 C4#3.1 DC1.2 DC1.3 DC2.2 DC2.3 DC5V.2 DC5V.3 DC5V#2.2 DC5V#2.3 DC12V.2 DC12V.3 DC12V#2.2 DC12V#2.3 H6.2 H7.8 H7.10 H7#2.8 H7#2.10 H7#3.8 H7#3.10 H8.2 H8.4 H8#2.2 H8#2.4 INT-1.1 INT-1#2.1 INT-1#3.1 INT-1#4.1 J1.2 J1#2.2 J1#3.2 J1#4.2 J2.1 J2.3 J2#2.1 J2#2.3 J2#3.1 J2#3.3 J2#4.1 J2#4.3 K230.2 K230#2.2 K230#3.2 LED1驱动板1.1 LED2电池1.1 LED5V1.1 LED指示1.1 LED指示1#2.1 LED指示1#3.1 OLED1.1 OLED1#2.1 OLED1#3.1 OUT-1.1 OUT-1#2.1 OUT-1#3.1 OUT-1#4.1 Q7.1 Q7#2.1 R10k3.2 R10k3#2.2 R10k3#3.2 SPI#2.6 SPI#2.8 SPI#3.6 SPI#3.8 SW4.1 SW4#2.1 SW4#3.1 SW5.1 SW5#2.1 SW5#3.1 SW6.1 SW6#2.1 SW6#3.1 SW7.1 SW7#2.1 SW7#3.1 SW8.1 SW8#2.1 SW8#3.1 SW9.1 SW10.2 SW10#2.2 SW10#3.2 U1.1 W25Q16存储器.3 W25Q16存储器#2.3 ZD1.1 ZD1#2.1 ZD1#3.1 八路灰度传感器.12 八路灰度传感器#2.12 八路灰度传感器#3.12 按键1.1 按键1#2.1 电机1.2 电机1#2.2 电机1#3.2 电机2.2 电机2#2.2 电机2#3.2 电机3.2 电机3#2.2 电机3#3.2 电机4.2 电机4#2.2 电机4#3.2 舵机1.3 舵机1#2.3 舵机1#3.3 舵机2.3 舵机2#2.3 舵机2#3.3 蓝牙.2 蓝牙#2.2 蓝牙#3.2 蜂鸣器.3 蜂鸣器#2.3 蜂鸣器#3.3
V12: 12V电源开关.2 12V电源开关#2.2 12V电源开关#3.2 DC1.1 DC12V.1 DC12V#2.1 H6.1 H8.1 H8.3 H8#2.1 H8#2.3
1: R10k1.1 R10k1#2.1 R10k1#3.1 R10k2.2 R10k2#2.2 R10k2#3.2 ZD1.2 ZD1#2.2 ZD1#3.2
2: Q1.2 Q1#2.2 Q1#3.2 R10k2.1 R10k2#2.1 R10k2#3.1
3: Q1.3 Q1#2.3 Q1#3.3 Q5.1 Q5#2.1 Q5#3.1 R10k3.1 R10k3#2.1 R10k3#3.1 R100k1.1 R100k1#2.1 R100k1#3.1
ERR: 八路灰度传感器.9 八路灰度传感器#2.9 八路灰度传感器#3.9
KEY: SW10.1 SW10#2.1 SW10#3.1 八路灰度传感器.10 八路灰度传感器#2.10 八路灰度传感器#3.10
M11: H2.1 H2#2.1 H2#3.1 电机1.1 电机1#2.1 电机1#3.1
M12: H2.2 H2#2.2 H2#3.2 电机1.6 电机1#2.6 电机1#3.6
M21: H3.1 H3#2.1 H3#3.1 电机2.1 电机2#2.1 电机2#3.1
M22: H3.2 H3#2.2 H3#3.2 电机2.6 电机2#2.6 电机2#3.6
M31: H4.1 H4#2.1 H4#3.1 电机3.1 电机3#2.1 电机3#3.1
M32: H4.2 H4#2.2 H4#3.2 电机3.6 电机3#2.6 电机3#3.6
M41: H5.1 H5#2.1 H5#3.1 电机4.1 电机4#2.1 电机4#3.1
M42: H5.2 H5#2.2 H5#3.2 电机4.6 电机4#2.6 电机4#3.6
NRST: J2.5 J2#2.5 J2#3.5 J2#4.5
PA0: J2.10 J2#2.10 J2#3.10 J2#4.10 OLED1.4 OLED1#2.4 OLED1#3.4
PA1: J2.9 J2#2.9 J2#3.9 J2#4.9 OLED1.3 OLED1#2.3 OLED1#3.3
PA2: J1.3 J1#2.3 J1#3.3 J1#4.3 SPI.7 SPI#2.7 SPI#3.7
PA3: J1.4 J1#2.4 J1#3.4 J1#4.4
PA4: J1.5 J1#2.5 J1#3.5 J1#4.5
PA5: J1.6 J1#2.6 J1#3.6 J1#4.6
PA6: J1.7 J1#2.7 J1#3.7 J1#4.7
PA7: J1.10 J1#2.10 J1#3.10 J1#4.10
PA8: J1.15 J1#2.15 J1#3.15 J1#4.15 蓝牙.4 蓝牙#2.4 蓝牙#3.4
PA9: J1.16 J1#2.16 J1#3.16 J1#4.16 蓝牙.3 蓝牙#2.3 蓝牙#3.3
PA10: J1.17 J1#2.17 J1#3.17 J1#4.17 K230.4 K230#2.4 K230#3.4
PA11: J1.18 J1#2.18 J1#3.18 J1#4.18 K230.3 K230#2.3 K230#3.3
PA12: J1.30 J1#2.30 J1#3.30 J1#4.30 L298N2.3 L298N2#2.3 L298N2#3.3
PA13: J1.31 J1#2.31 J1#3.31 J1#4.31 LED11.1 LED11#2.1 LED11#3.1 SW5.2 SW5#2.2 SW5#3.2
PA14: J1.32 J1#2.32 J1#3.32 J1#4.32 LED12.1 LED12#2.1 LED12#3.1 SW4.2 SW4#2.2 SW4#3.2
PA15: J2.32 J2#2.32 J2#3.32 J2#4.32 L298N2.1 L298N2#2.1 L298N2#3.1
PA16: J2.31 J2#2.31 J2#3.31 J2#4.31 SPI.6 W25Q16存储器.1 W25Q16存储器#2.1
PA17: J2.30 J2#2.30 J2#3.30 J2#4.30 SPI.2 W25Q16存储器.2 W25Q16存储器#2.2
PA18: J2.29 J2#2.29 J2#3.29 J2#4.29 SPI.4 W25Q16存储器.4 W25Q16存储器#2.4
PA21: J2.25 J2#2.25 J2#3.25 J2#4.25 L298N1.1 L298N1#2.1 L298N1#3.1
PA22: J2.24 J2#2.24 J2#3.24 J2#4.24 L298N1.3 L298N1#2.3 L298N1#3.3
PA23: J2.18 J2#2.18 J2#3.18 J2#4.18 LED15.1 LED15#2.1 LED15#3.1 SW6.2 SW6#2.2 SW6#3.2
PA24: J2.17 J2#2.17 J2#3.17 J2#4.17 舵机2.1 舵机2#2.1 舵机2#3.1
PA25: J2.16 J2#2.16 J2#3.16 J2#4.16 LED16.1 LED16#2.1 LED16#3.1 SW7.2 SW7#2.2 SW7#3.2
PA26: J2.12 J2#2.12 J2#3.12 J2#4.12 SPI.8 W25Q16存储器.5 W25Q16存储器#2.5
PA27: J2.11 J2#2.11 J2#3.11 J2#4.11 LED17.1 LED17#2.1 LED17#3.1 SW8.2 SW8#2.2 SW8#3.2
PA28: J2.8 J2#2.8 J2#3.8 J2#4.8 舵机1.1 舵机1#2.1 舵机1#3.1
PA29: 6050.6 6050#2.6 6050#3.6 6050#4.6 J2.7 J2#2.7 J2#3.7 J2#4.7
PA30: 6050.5 6050#2.5 6050#3.5 6050#4.5 J2.6 J2#2.6 J2#3.6 J2#4.6
PA31: J2.4 J2#2.4 J2#3.4 J2#4.4 LED18.1 LED18#2.1 LED18#3.1 SW9.2 按键1.2 按键1#2.2
PB0: J1.8 J1#2.8 J1#3.8 J1#4.8 八路灰度传感器.8 八路灰度传感器#2.8 八路灰度传感器#3.8
PB1: J1.9 J1#2.9 J1#3.9 J1#4.9 八路灰度传感器.7 八路灰度传感器#2.7 八路灰度传感器#3.7
PB2: J1.11 J1#2.11 J1#3.11 J1#4.11 八路灰度传感器.6 八路灰度传感器#2.6 八路灰度传感器#3.6
PB3: J1.12 J1#2.12 J1#3.12 J1#4.12 八路灰度传感器.5 八路灰度传感器#2.5 八路灰度传感器#3.5
PB4: J1.13 J1#2.13 J1#3.13 J1#4.13 八路灰度传感器.4 八路灰度传感器#2.4 八路灰度传感器#3.4 蜂鸣器.2
PB5: J1.14 J1#2.14 J1#3.14 J1#4.14 八路灰度传感器.3 八路灰度传感器#2.3 八路灰度传感器#3.3
PB6: J1.19 J1#2.19 J1#3.19 J1#4.19 八路灰度传感器.2 八路灰度传感器#2.2 八路灰度传感器#3.2
PB7: J1.20 J1#2.20 J1#3.20 J1#4.20 八路灰度传感器.1 八路灰度传感器#2.1 八路灰度传感器#3.1
PB8: 6050.1 6050#2.1 6050#3.1 6050#4.1 H7.1 J1.21 J1#2.21 J1#3.21 J1#4.21
PB9: H7.3 H7#2.3 H7#3.3 J1.22 J1#2.22 J1#3.22 J1#4.22 蜂鸣器#2.2 蜂鸣器#3.2
PB10: H7.5 H7#2.5 H7#3.5 J1.23 J1#2.23 J1#3.23 J1#4.23
PB11: H7.7 H7#2.7 H7#3.7 J1.24 J1#2.24 J1#3.24 J1#4.24
PB12: H7.9 H7#2.9 H7#3.9 J1.25 J1#2.25 J1#3.25 J1#4.25 LED指示1.2 LED指示1#2.2 LED指示1#3.2
PB13: J1.26 J1#2.26 J1#3.26 J1#4.26 L298N1.2 L298N1#2.2 L298N1#3.2
PB14: J1.27 J1#2.27 J1#3.27 J1#4.27 L298N1.4 L298N1#2.4 L298N1#3.4
PB15: J1.28 J1#2.28 J1#3.28 J1#4.28 L298N2.2 L298N2#2.2 L298N2#3.2
PB16: J1.29 J1#2.29 J1#3.29 J1#4.29 L298N2.4 L298N2#2.4 L298N2#3.4
PB17: J2.28 J2#2.28 J2#3.28 J2#4.28 SPI.3 SPI#2.3 SPI#3.3
PB18: J2.27 J2#2.27 J2#3.27 J2#4.27 SPI.1 SPI#2.1 SPI#3.1
PB19: J2.26 J2#2.26 J2#3.26 J2#4.26 SPI.5 SPI#2.5 SPI#3.5
PB20: J2.23 J2#2.23 J2#3.23 J2#4.23 电机1.3 电机1#2.4 电机1#3.4
PB21: J2.22 J2#2.22 J2#3.22 J2#4.22 电机1.4 电机1#2.3 电机1#3.3
PB22: J2.21 J2#2.21 J2#3.21 J2#4.21 电机2.3 电机2#2.4 电机2#3.4
PB23: J2.20 J2#2.20 J2#3.20 J2#4.20 电机2.4 电机2#2.3 电机2#3.3
PB24: J2.19 J2#2.19 J2#3.19 J2#4.19 电机3.3 电机3#2.4 电机3#3.4
PB25: J2.15 J2#2.15 J2#3.15 J2#4.15 电机3.4 电机3#2.3 电机3#3.3
PB26: J2.14 J2#2.14 J2#3.14 J2#4.14 电机4.3 电机4#2.4 电机4#3.4
PB27: J2.13 J2#2.13 J2#3.13 J2#4.13 电机4.4 电机4#2.3 电机4#3.3
$1N2660: LED11.2 LED11#2.2 LED11#3.2 R41k4.1 R41k4#2.1 R41k4#3.1
$1N2663: LED12.2 LED12#2.2 LED12#3.2 R41k1.1 R41k1#2.1 R41k1#3.1
$1N2664: LED15.2 LED15#2.2 LED15#3.2 R41k2.1 R41k2#2.1 R41k2#3.1
$1N2665: LED16.2 LED16#2.2 LED16#3.2 R41k3.1 R41k3#2.1 R41k3#3.1
$1N3106: LED17.2 LED17#2.2 LED17#3.2 R41k5.1 R41k5#2.1 R41k5#3.1
$1N3187: LED18.2 LED18#2.2 LED18#3.2 R41k6.1 R41k6#2.1 R41k6#3.1
$1N5510: C1.2 C3.2 D1.1 U1.3
$1N6143: 3.3V指示灯.2 3.3V指示灯#2.2 LED2电池1.2 R247.2 R247#2.2 R2470.2
$1N6144: 12V指示灯.2 12V指示灯#2.2 LED1驱动板1.2 R1470.2 R11000.2 R11000#2.2
$1N6148: 5V指示灯.2 5V指示灯#2.2 LED5V1.2 R3470.2 R3470#2.2 R3470#3.2
$1N7398: D2.2 D2#2.2 D2#3.2 INT+1.1 INT+1#2.1 INT+1#3.1 INT+1#4.1

Pads without a net: 5V电源选择 3; 12V电源开关 3; 12V电源开关#2 3; 12V电源开关#3 3; 6050 2 3 4; 6050#2 2 3 4; 6050#3 2 3 4; 6050#4 2 3 4; INT+1 2; INT+1#2 2; INT+1#3 2; INT+1#4 2; INT-1 2; INT-1#2 2; INT-1#3 2; INT-1#4 2; OUT+1 2; OUT+1#2 2; OUT+1#3 2; OUT+1#4 2; OUT-1 2; OUT-1#2 2; OUT-1#3 2; OUT-1#4 2

## Via types
v1: diameter 3.3, hole 3, Top Layer to Bottom Layer, 44 vias
v2: diameter 4, hole 3.9, Top Layer to Bottom Layer, 24 vias
v3: diameter 1, hole 0.8, Top Layer to Bottom Layer, 28 vias
v4: diameter 0.61, hole 0.305, Top Layer to Bottom Layer, 128 vias
v5: diameter 0.7, hole 0.5, Top Layer to Bottom Layer, 16 vias
v6: diameter 0.61, hole 0.5, Top Layer to Bottom Layer, 2 vias
v7: diameter 1.4, hole 1.2, Top Layer to Bottom Layer, 4 vias

## Routing (per net, layer and track width the routed paths; a pad name or vN(x,y) marks a point on that pad's centre or on a via; arc(x,y) is an arc through that point)
3V3: length 797.5
  Top Layer w0.5: R41k5#2.2 452.62,151.44 ; R41k5#2.2 452.62,151.44 ; R41k5#2.2 R41k6#2.2 ; R41k5#2.2 R41k6#2.2 ; 452.62,151.44 453.01,151.05 ; 452.62,151.44 453.01,151.05 ; 430.14,231.33 429.26,232.21 ; 430.14,231.33 430.14,229.86 ; 430.14,231.33 429.26,232.21 ; 430.14,231.33 430.14,229.86 ; 429.26,232.21 421.39,232.21 ; 429.26,232.21 421.39,232.21 ; 439.18,229.78 C2#2.2 ; 439.18,229.78 440.61,228.35 ; 439.18,229.78 440.61,228.35 ; 439.18,229.78 C2#2.2 ; C2#2.2 435.27,229.86 ; C2#2.2 435.27,229.86 ; R41k2#2.2 464.18,150.94 ; R41k2#2.2 460.62,150.94 ; R41k2#2.2 464.18,150.94 ; R41k2#2.2 460.62,150.94 ; 464.18,150.94 465.46,149.66 ; 464.18,150.94 465.46,149.66 ; 418.21,229.03 387.86,229.03 ; 418.21,229.03 421.39,232.21 ; 418.21,229.03 421.39,232.21 ; 418.21,229.03 387.86,229.03 ; 387.86,229.03 蜂鸣器#2.1 387.86,229.03 ; R41k4#2.2 478.76,150.71 ; R41k4#2.2 471.72,150.71 ; R41k4#2.2 478.76,150.71 ; R41k4#2.2 471.72,150.71 ; 478.76,150.71 R41k1#2.2 478.76,150.71 ; 453.01,151.05 456.43,151.05 ; 453.01,151.05 456.43,151.05 ; 471.93,203.24 471.93,199.58 ; 471.93,203.24 471.93,199.58 ; 471.93,203.24 R247.1 471.93,203.24 ; 471.93,199.58 471.67,199.31 ; 471.93,199.58 471.67,199.31 ; 430.14,229.86 428.44,229.86 ; 430.14,229.86 C4#2.2 ; 430.14,229.86 428.44,229.86 ; 430.14,229.86 C4#2.2 ; 428.44,229.86 426.97,228.4 ; 428.44,229.86 426.97,228.4 ; 465.46,149.66 470.66,149.66 ; 465.46,149.66 470.66,149.66 ; 470.66,149.66 471.72,150.71 ; 470.66,149.66 471.72,150.71 ; 435.27,229.86 C4#2.2 ; 435.27,229.86 C4#2.2 ; 440.61,228.35 440.61,225.08 440.61,228.35 ; 471.67,199.31 v6(463.42,199.31) 471.67,199.31 ; 443.35,151.44 R41k6#2.2 ; 443.35,151.44 R41k6#2.2 ; 443.35,151.44 v5(439.55,151.44) 443.35,151.44 ; 460.62,150.94 460.49,151.06 ; 460.62,150.94 460.49,151.06 ; 460.49,151.06 R41k3#2.2 ; 460.49,151.06 R41k3#2.2 ; 426.97,228.4 v5(426.97,203.51) 426.97,228.4 ; 456.43,151.05 R41k3#2.2 ; 456.43,151.05 R41k3#2.2
  Inner1 w0.5: H7#2.6 396.56,193.28 ; H7#2.6 396.56,193.28 ; H7#2.6 401.16,193.22 ; H7#2.6 401.16,193.22 ; 396.56,193.28 396.56,195.7 ; 396.56,193.28 396.56,195.7 ; 437.51,203.51 438.15,204.14 ; 437.51,203.51 v5(426.97,203.51) ; 437.51,203.51 v5(426.97,203.51) ; 437.51,203.51 438.15,204.14 ; 438.15,204.14 438.15,206.93 ; 438.15,204.14 438.15,206.93 ; 402.34,144.32 389.89,144.32 ; 402.34,144.32 389.89,144.32 ; 402.34,144.32 404.5,146.48 ; 402.34,144.32 404.5,146.48 ; 389.89,144.32 386.97,147.24 ; 389.89,144.32 386.97,147.24 ; 455.21,193.47 455.42,193.26 ; 455.21,193.47 447.04,193.47 ; 455.21,193.47 447.04,193.47 ; 455.21,193.47 455.42,193.26 ; 455.42,193.26 OLED1#2.2 455.42,193.26 ; SPI#2.4 SPI#2.2 SPI#2.4 ; SPI#2.4 438.15,206.93 ; SPI#2.4 438.15,206.93 ; v5(446.99,193.53) 446.99,191.39 ; v5(446.99,193.53) 443.43,193.53 ; v5(446.99,193.53) 446.99,191.39 ; v5(446.99,193.53) 447.04,193.47 ; v5(446.99,193.53) 447.04,193.47 ; v5(446.99,193.53) 443.43,193.53 ; 446.99,191.39 443.87,188.27 ; 446.99,191.39 443.87,188.27 ; v5(426.97,203.51) 407.67,203.51 ; v5(426.97,203.51) 426.97,201.09 ; v5(426.97,203.51) 407.67,203.51 ; v5(426.97,203.51) 426.97,201.09 ; 401.19,157.02 404.5,153.72 ; 401.19,157.02 404.5,153.72 ; 401.19,157.02 v5(401.19,193.19) ; 401.19,157.02 v5(401.19,193.19) ; 404.5,153.72 404.5,146.48 ; 404.5,153.72 404.5,146.48 ; 434.46,195.82 J2#3.2 434.46,195.82 ; 434.46,195.82 v5(434.46,198.81) ; 434.46,195.82 v5(434.46,198.81) ; 450.99,199.26 6050.8 450.99,199.26 ; 450.99,199.26 v5(450.94,199.31) ; 450.99,199.26 v5(450.94,199.31) ; 396.56,195.7 H7#2.4 396.56,195.7 ; 386.97,147.24 W25Q16存储器.6 386.97,147.24 ; 429.26,198.81 v5(434.46,198.81) ; 429.26,198.81 426.97,201.09 ; 429.26,198.81 v5(434.46,198.81) ; 429.26,198.81 426.97,201.09 ; v5(434.46,198.81) 438.15,198.81 ; v5(434.46,198.81) 434.46,200.07 ; v5(434.46,198.81) 434.46,200.07 ; v5(434.46,198.81) 438.15,198.81 ; 443.43,193.53 438.15,198.81 ; 443.43,193.53 438.15,198.81 ; v5(406.56,199.11) 403.4,199.11 ; v5(406.56,199.11) 406.56,202.4 ; v5(406.56,199.11) 403.4,199.11 ; v5(406.56,199.11) J1#3.1 v5(406.56,199.11) ; v5(406.56,199.11) 406.56,202.4 ; 403.4,199.11 401.19,196.9 ; 403.4,199.11 401.19,196.9 ; 443.87,169.09 442.6,167.82 ; 443.87,169.09 443.87,188.27 ; 443.87,169.09 443.87,188.27 ; 443.87,169.09 442.6,167.82 ; 442.6,167.82 439.42,167.82 ; 442.6,167.82 439.42,167.82 ; v5(450.94,199.31) 449.45,199.31 ; v5(450.94,199.31) v6(463.42,199.31) v5(450.94,199.31) ; v5(450.94,199.31) 449.45,199.31 ; 439.42,167.82 439.07,167.46 ; 439.42,167.82 439.07,167.46 ; 439.07,167.46 439.07,151.92 ; 439.07,167.46 439.07,151.92 ; 401.19,196.9 v5(401.19,193.19) ; 401.19,196.9 v5(401.19,193.19) ; 448.18,200.58 449.45,199.31 ; 448.18,200.58 434.98,200.58 ; 448.18,200.58 449.45,199.31 ; 448.18,200.58 434.98,200.58 ; 434.46,200.07 434.98,200.58 ; 434.46,200.07 434.98,200.58 ; 407.67,203.51 406.56,202.4 ; 407.67,203.51 406.56,202.4 ; 401.16,193.22 v5(401.19,193.19) ; 401.16,193.22 v5(401.19,193.19) ; 439.07,151.92 v5(439.55,151.44) 439.07,151.92
  vias: v5(430.08,229.91) v5(430.08,229.91)
5V: length 597.5
  Top Layer w0.8: v3(432,214.94) 432,218.18 ; v3(432,214.94) 432.94,214.94 ; v3(432,214.94) 432.94,214.94 ; v3(432,214.94) 428.88,214.94 ; v3(432,214.94) 428.88,214.94 ; v3(432,214.94) 432,218.18 ; 432,218.18 C1#2.2 432,218.18 ; 435.28,215.32 v3(442.03,215.32) 435.28,215.32 ; 435.28,215.32 435.23,215.37 ; 435.28,215.32 435.23,215.37 ; 432.94,214.94 433.27,215.26 ; 432.94,214.94 433.27,215.26 ; 428.62,215.19 v3(428.62,215.77) 428.62,215.19 ; 428.62,215.19 428.88,214.94 ; 428.62,215.19 428.88,214.94 ; 470.41,207.7 R3470#2.1 470.41,207.7 ; 470.41,207.7 469.71,207 ; 470.41,207.7 469.71,207 ; 456.37,212.08 457.45,213.16 ; 456.37,212.08 442.79,212.08 ; 456.37,212.08 442.79,212.08 ; 456.37,212.08 457.45,213.16 ; 457.45,213.16 457.45,216.33 ; 457.45,213.16 457.45,216.33 ; 442.11,212.76 Q7.3 442.11,212.76 ; 442.11,212.76 442.79,212.08 ; 442.11,212.76 442.79,212.08 ; 469.71,207 v3(469.71,200.91) 469.71,207 ; 457.45,216.33 5V电源选择#2.2 457.45,216.33 ; 435.23,215.37 C3#2.2 435.23,215.37 ; 433.27,215.26 v3(435.2,215.26) 433.27,215.26
  Inner1 w0.8: v3(393.7,213.35) 393.7,204.14 ; v3(393.7,213.35) 396.02,213.35 ; v3(393.7,213.35) 396.02,213.35 ; v3(393.7,213.35) 390.08,213.35 ; v3(393.7,213.35) v3(393.7,219.97) ; v3(393.7,213.35) v3(393.7,219.97) ; v3(393.7,213.35) 390.08,213.35 ; v3(393.7,213.35) 393.7,204.14 ; 393.7,204.14 392.18,202.62 ; 393.7,204.14 392.18,202.62 ; v3(393.7,219.97) 389.05,219.97 ; v3(393.7,219.97) 389.05,219.97 ; v3(393.7,219.97) 394.34,219.97 ; v3(393.7,219.97) 394.34,219.97 ; 389.05,219.97 388.75,220.27 ; 389.05,219.97 388.75,220.27 ; 428.62,230.3 426.59,232.33 ; 428.62,230.3 426.59,232.33 ; 428.62,230.3 v3(428.62,215.77) 428.62,230.3 ; 426.59,232.33 415.42,232.33 ; 426.59,232.33 415.42,232.33 ; H7#2.2 H7#2.1 H7#2.2 ; H7#2.2 396.75,198.43 ; H7#2.2 396.75,198.43 ; 390.08,213.35 388.69,214.74 ; 390.08,213.35 388.69,214.74 ; 388.69,214.74 388.69,217.42 ; 388.69,214.74 388.69,217.42 ; 415.42,232.29 v3(415.41,232.28) 415.42,232.29 ; 415.42,232.29 415.42,232.33 ; 415.42,232.29 415.42,232.33 ; 415.42,232.33 八路灰度传感器#2.11 415.42,232.33 ; 415.42,232.33 411.73,232.33 ; 415.42,232.33 411.73,232.33 ; 388.94,199.26 389.51,199.82 ; 388.94,199.26 v3(388.94,181.09) ; 388.94,199.26 389.51,199.82 ; 388.94,199.26 v3(388.94,181.09) ; 389.51,199.82 391.41,199.82 ; 389.51,199.82 391.41,199.82 ; 388.88,181.03 电机3#2.5 388.88,181.03 ; 388.88,181.03 v3(388.94,181.09) ; 388.88,181.03 v3(388.94,181.09) ; 388.69,217.42 舵机2#2.2 388.69,217.42 ; 470.53,198.81 472.06,198.81 ; 470.53,198.81 469.77,199.57 ; 470.53,198.81 469.77,199.57 ; 470.53,198.81 472.06,198.81 ; 472.06,198.81 472.91,197.96 ; 472.06,198.81 472.91,197.96 ; 411.73,232.33 410.59,231.19 ; 411.73,232.33 410.59,231.19 ; 410.59,231.19 410.59,230.18 ; 410.59,231.19 410.59,230.18 ; 469.77,200.85 469.77,199.57 ; 469.77,200.85 v3(469.71,200.91) 469.77,200.85 ; 469.77,200.85 469.77,199.57 ; 409.58,229.16 396.11,229.16 ; 409.58,229.16 396.11,229.16 ; 409.58,229.16 410.59,230.18 ; 409.58,229.16 410.59,230.18 ; 396.11,229.16 394.34,227.38 ; 396.11,229.16 394.34,227.38 ; 391.03,156.9 391.92,156.01 ; 391.03,156.9 391.03,166.49 ; 391.03,156.9 391.92,156.01 ; 391.03,156.9 391.03,166.49 ; 391.92,156.01 394.59,156.01 ; 391.92,156.01 394.59,156.01 ; v3(392.18,201.56) 386.81,201.56 ; v3(392.18,201.56) 395.88,201.56 ; v3(392.18,201.56) 392.18,200.58 ; v3(392.18,201.56) 392.18,202.62 ; v3(392.18,201.56) 395.88,201.56 ; v3(392.18,201.56) 392.18,200.58 ; v3(392.18,201.56) 392.18,202.62 ; v3(392.18,201.56) 386.81,201.56 ; 386.81,201.56 电机1#2.5 386.81,201.56 ; 391.03,166.49 389.76,167.76 ; 391.03,166.49 389.76,167.76 ; 394.34,219.97 394.34,227.38 ; 394.34,219.97 394.34,227.38 ; 396.02,213.35 蓝牙#2.1 396.02,213.35 ; 472.91,197.96 472.91,181.83 ; 472.91,197.96 472.91,181.83 ; 472.91,181.83 474.47,180.26 ; 472.91,181.83 474.47,180.26 ; 395.88,201.56 396.75,200.7 ; 395.88,201.56 396.75,200.7 ; v3(388.94,181.09) 388.94,177.03 ; v3(388.94,181.09) 388.94,177.03 ; 388.94,177.03 386.33,174.42 ; 388.94,177.03 386.33,174.42 ; 392.18,200.58 391.41,199.82 ; 392.18,200.58 391.41,199.82 ; 456.31,200.97 480.95,200.97 456.31,200.97 ; 456.31,200.97 455.27,202 ; 456.31,200.97 455.27,202 ; 394.59,156.01 K230#2.1 394.59,156.01 ; 386.33,174.42 386.33,168.33 ; 386.33,174.42 386.33,168.33 ; 455.27,202 v3(455.27,212.02) 455.27,202 ; 396.75,200.7 396.75,198.43 ; 396.75,200.7 396.75,198.43 ; 386.9,167.76 389.76,167.76 ; 386.9,167.76 386.33,168.33 ; 386.9,167.76 386.33,168.33 ; 386.9,167.76 389.76,167.76 ; 388.75,220.27 舵机1#2.2 388.75,220.27 ; 474.47,180.26 电机4#2.5 474.47,180.26
5V1: length 24
  Inner1 w0.8: 466.85,216.46 469.3,214.01 ; 466.85,216.46 469.3,214.01 ; 466.85,216.46 5V电源选择#2.1 466.85,216.46 ; 469.3,214.01 DC5V.1 469.3,214.01
5V2: length 119.3
  Inner1 w0.8: 405.38,227.25 Q1#2.1 ; 405.38,227.25 402.46,224.33 ; 405.38,227.25 Q1#2.1 ; 405.38,227.25 402.46,224.33 ; Q1#2.1 413.75,227.25 ; Q1#2.1 413.75,227.25 ; 406.53,215.53 OUT+1#3.1 406.53,215.53 ; 406.53,215.53 v3(406.53,210.2) ; 406.53,215.53 v3(406.53,210.2) ; 402.46,224.33 402.46,210.62 ; 402.46,224.33 402.46,210.62 ; 418.08,205.66 407.42,205.66 ; 418.08,205.66 418.72,206.3 ; 418.08,205.66 407.42,205.66 ; 418.08,205.66 418.72,206.3 ; 407.42,205.66 406.53,206.55 ; 407.42,205.66 406.53,206.55 ; 418.72,206.3 Q5#2.3 418.72,206.3 ; 402.46,210.62 402.88,210.2 ; 402.46,210.62 402.88,210.2 ; 413.75,227.25 R100k1#2.2 ; 413.75,227.25 R100k1#2.2 ; 414.02,223.26 R10k1#2.2 414.02,223.26 ; 414.02,223.26 414.02,226.98 ; 414.02,223.26 414.02,226.98 ; 406.53,206.55 v3(406.53,210.2) ; 406.53,206.55 v3(406.53,210.2) ; v3(406.53,210.2) 402.88,210.2 ; v3(406.53,210.2) 402.88,210.2 ; R100k1#2.2 414.02,226.98 ; R100k1#2.2 414.02,226.98
5V3: length 84.4
  Inner1 w0.8: 452.53,213.31 451.49,212.27 ; 452.53,213.31 5V电源选择#2.3 452.53,213.31 ; 452.53,213.31 451.49,212.27 ; 451.49,212.27 417.7,212.27 ; 451.49,212.27 417.7,212.27 ; 416.18,210.74 Q5#2.2 416.18,210.74 ; 416.18,210.74 417.7,212.27 ; 416.18,210.74 417.7,212.27
12V: length 55.9
  Top Layer w1.2: 471.95,234.05 R11000.1 471.95,234.05 ; 471.95,234.05 469.6,234.05 ; 471.95,234.05 469.6,234.05 ; 457.21,235.38 468.28,235.38 ; 457.21,235.38 D2#2.1 ; 457.21,235.38 468.28,235.38 ; 457.21,235.38 D2#2.1 ; 468.28,235.38 469.6,234.05 ; 468.28,235.38 469.6,234.05 ; 453.9,226.21 12V电源开关#2.1 453.9,226.21 ; 453.9,226.21 453.9,228.93 ; 453.9,226.21 453.9,228.93 ; 453.9,228.93 454.89,229.92 ; 453.9,228.93 454.89,229.92 ; 454.89,229.92 454.91,229.92 ; 454.89,229.92 454.91,229.92 ; D2#2.1 455.44,230.45 ; D2#2.1 455.44,230.45 ; 454.91,229.92 455.44,230.45 ; 454.91,229.92 455.44,230.45
V12: length 55.4
  Inner1 w1.2: 464.8,232.19 464.82,232.21 464.8,232.19 ; 464.8,232.19 v7(464.8,228.65) ; 464.8,232.19 v7(464.8,228.65) ; 471.72,226.07 DC12V.1 471.72,226.07 ; 471.72,226.07 469.14,228.65 ; 471.72,226.07 469.14,228.65 ; 469.14,228.65 v7(464.8,228.65) ; 469.14,228.65 v7(464.8,228.65) ; v7(464.8,228.65) v7(459.62,228.65) ; v7(464.8,228.65) v7(459.62,228.65) ; v7(459.62,228.65) 457.96,228.65 ; v7(459.62,228.65) 459.62,232.09 ; v7(459.62,228.65) 457.96,228.65 ; v7(459.62,228.65) 459.62,232.09 ; 457.33,228.02 12V电源开关#2.2 457.33,228.02 ; 457.33,228.02 457.96,228.65 ; 457.33,228.02 457.96,228.65 ; 459.62,232.09 H8.1 459.62,232.09
(no net):
  vias: v1(11.68,138.86) v1(91.57,138.74) v1(244.2,127.86) v1(244.32,164.9) v1(248.54,192.84) v1(281.23,127.74) v1(281.36,164.77) v1(292.99,127.87) v1(293.12,164.9) v1(307.48,231.47) v1(322.22,231.47) v1(328.42,192.71) v1(330.02,127.74) v1(330.15,164.77) v1(337.06,77.14) v1(337.06,62.41) v1(358.52,40.24) v1(358.65,77.27) v1(389.23,104.62) v1(389.23,104.62) v1(389.36,141.65) v1(389.36,141.65) v1(393.57,177.6) v1(393.57,177.6) v1(395.55,40.11) v1(395.68,77.14) v1(426.26,104.5) v1(426.26,104.5) v1(426.39,141.53) v1(426.39,141.53) v1(438.02,104.62) v1(438.02,104.62) v1(438.15,141.66) v1(438.15,141.66) v1(452.52,208.23) v1(452.52,208.23) v1(467.25,208.23) v1(467.25,208.23) v1(473.58,177.6) v1(473.58,177.6) v1(475.05,104.5) v1(475.05,104.5) v1(475.18,141.53) v1(475.18,141.53) v2(14.99,85.14) v2(14.99,15.16) v2(16.64,191.82) v2(16.64,121.84) v2(84.96,85.14) v2(84.96,15.16) v2(86.61,191.82) v2(86.61,121.84) v2(132.54,94.02) v2(132.54,24.04) v2(202.52,94.02) v2(202.52,24.04) v2(253.49,245.8) v2(253.49,175.82) v2(323.47,245.8) v2(323.47,175.82) v2(398.53,222.56) v2(398.53,222.56) v2(398.53,152.58) v2(398.53,152.58) v2(468.5,222.56) v2(468.5,222.56) v2(468.5,152.58) v2(468.5,152.58)
1: length 21.6
  Inner1 w0.8: 423.87,218.69 420.5,215.32 ; 423.87,218.69 R10k2#2.2 ; 423.87,218.69 420.5,215.32 ; 423.87,218.69 R10k2#2.2 ; 420.5,215.32 ZD1#2.2 420.5,215.32 ; R10k2#2.2 424,219.51 ; R10k2#2.2 424,219.51 ; 424,219.51 424,222.94 424,219.51
2: length 19.5
  Inner1 w0.8: 411.23,223.57 411.23,220.14 ; 411.23,223.57 410.08,224.71 ; 411.23,223.57 410.08,224.71 ; 411.23,223.57 411.23,220.14 ; 411.23,220.14 411.99,219.38 ; 411.23,220.14 411.99,219.38 ; 410.08,224.71 Q1#2.2 410.08,224.71 ; 411.99,219.38 R10k2#2.1 411.99,219.38
3: length 85.8
  Inner1 w0.8: 410.85,217.22 v3(413.66,217.22) ; 410.85,217.22 v3(413.66,217.22) ; 410.85,217.22 409.47,218.6 ; 410.85,217.22 409.47,218.6 ; v3(413.66,217.22) 413.64,217.2 ; v3(413.66,217.22) 415.54,217.22 ; v3(413.66,217.22) 415.54,217.22 ; v3(413.66,217.22) 413.64,217.2 ; v3(417.83,227.14) 424.06,227.14 ; v3(417.83,227.14) 417.83,229.92 ; v3(417.83,227.14) 417.83,229.92 ; v3(417.83,227.14) 417.83,219.51 ; v3(417.83,227.14) 424.06,227.14 ; v3(417.83,227.14) 417.83,219.51 ; 424.06,227.14 424.07,227.13 424.06,227.14 ; 417.2,230.56 414.2,230.56 ; 417.2,230.56 417.83,229.92 ; 417.2,230.56 414.2,230.56 ; 417.2,230.56 417.83,229.92 ; 414.2,230.56 R10k3#2.1 414.2,230.56 ; 415.54,217.22 417.83,219.51 ; 415.54,217.22 417.83,219.51 ; 413.64,217.2 Q5#2.1 413.64,217.2 ; 409.47,220.76 Q1#2.3 409.47,220.76 ; 409.47,220.76 409.47,218.6 ; 409.47,220.76 409.47,218.6
KEY: length 48.8
  Bottom Layer w0.3: 404.62,229.03 403.86,229.79 ; 404.62,229.03 403.86,229.79 ; 404.62,229.03 417.32,229.03 ; 404.62,229.03 417.32,229.03 ; 403.86,229.79 403.86,232.97 ; 403.86,229.79 403.86,232.97 ; 417.96,229.67 417.32,229.03 ; 417.96,229.67 417.32,229.03 ; 417.96,229.67 八路灰度传感器#2.10 417.96,229.67 ; 403.35,233.48 SW10#2.1 403.35,233.48 ; 403.35,233.48 403.86,232.97 ; 403.35,233.48 403.86,232.97
M11: length 14.5
  Top Layer w0.3: 390.14,210.62 H2#2.1 390.14,210.62 ; 390.14,210.62 389.51,211.25 ; 390.14,210.62 389.51,211.25 ; 389.51,211.25 电机1#2.1 389.51,211.25
M12: length 18.8
  Top Layer w0.3: 390.14,199.82 H2#2.2 390.14,199.82 ; 390.14,199.82 388.87,198.55 ; 390.14,199.82 388.87,198.55 ; 388.87,198.55 电机1#2.6 388.87,198.55
M21: length 9.5
  Top Layer w0.3: 480.57,190.42 H3#2.1 480.57,190.42 ; 480.57,190.42 电机2#2.1 480.57,190.42
M22: length 26.8
  Top Layer w0.3: 477.52,201.73 476.38,200.58 ; 477.52,201.73 476.38,200.58 ; 477.52,201.73 479.17,201.73 ; 477.52,201.73 479.17,201.73 ; 476.38,200.58 H3#2.2 476.38,200.58 ; 479.17,201.73 480.95,203.51 479.17,201.73
M31: length 55.7
  Top Layer w0.3: 392.18,174.55 392.18,170.99 ; 392.18,174.55 391.67,175.06 ; 392.18,174.55 392.18,170.99 ; 392.18,174.55 391.67,175.06 ; 392.18,170.99 391.92,170.74 ; 392.18,170.99 391.92,170.74 ; 389.89,176.07 390.91,175.06 ; 389.89,176.07 390.91,175.06 ; 389.89,176.07 389.89,190.89 ; 389.89,176.07 389.89,190.89 ; 390.91,175.06 391.67,175.06 ; 390.91,175.06 391.67,175.06 ; 391.92,170.74 H4#2.1 391.92,170.74 ; 389.89,190.89 389.59,191.19 ; 389.89,190.89 389.59,191.19 ; 389.59,191.19 电机3#2.1 389.59,191.19
M32: length 18.2
  Top Layer w0.3: 386.46,173.28 H4#2.2 386.46,173.28 ; 386.46,173.28 385.95,173.79 ; 386.46,173.28 385.95,173.79 ; 385.95,173.79 385.95,178.23 ; 385.95,173.79 385.95,178.23 ; 385.95,178.23 电机3#2.6 385.95,178.23
M41: length 13.3
  Top Layer w0.3: 478.79,170.23 479,170.02 ; 478.79,170.23 479,170.02 ; 478.79,170.23 478.79,172.01 ; 478.79,170.23 478.79,172.01 ; 479,170.02 480.61,170.02 ; 479,170.02 480.61,170.02 ; 478.03,172.77 H5#2.1 478.03,172.77 ; 478.03,172.77 478.79,172.01 ; 478.03,172.77 478.79,172.01 ; 480.61,170.02 电机4#2.1 480.61,170.02
M42: length 35.2
  Top Layer w0.3: 474.09,171.25 475.11,170.23 ; 474.09,171.25 474.09,174.17 ; 474.09,171.25 474.09,174.17 ; 474.09,171.25 475.11,170.23 ; 475.11,170.23 H5#2.2 475.11,170.23 ; 479.81,181.92 电机4#2.6 479.81,181.92 ; 479.81,181.92 478.54,181.92 ; 479.81,181.92 478.54,181.92 ; 478.32,178.4 474.09,174.17 ; 478.32,178.4 474.09,174.17 ; 478.32,178.4 478.32,181.7 ; 478.32,178.4 478.32,181.7 ; 478.54,181.92 478.32,181.7 ; 478.54,181.92 478.32,181.7
PA0: length 62.4
  Top Layer w0.3: 440.66,185.57 J2#3.10 440.66,185.57 ; 440.66,185.57 v4(440.69,185.6) 440.66,185.57
  Bottom Layer w0.3: 460.5,186.74 459.74,185.98 ; 460.5,186.74 459.74,185.98 ; 460.5,186.74 OLED1#2.4 460.5,186.74 ; 459.74,185.98 441.07,185.98 ; 459.74,185.98 441.07,185.98 ; 441.07,185.98 v4(440.69,185.6) 441.07,185.98
PA1: length 60.7
  Top Layer w0.3: 431.83,186.39 J2#3.9 431.83,186.39 ; 431.83,186.39 432.18,186.74 ; 431.83,186.39 432.18,186.74 ; 432.18,186.74 439.93,186.74 ; 432.18,186.74 439.93,186.74 ; 439.93,186.74 v4(440.31,187.12) 439.93,186.74
  Bottom Layer w0.3: 457.96,189.03 456.06,187.12 ; 457.96,189.03 456.06,187.12 ; 457.96,189.03 OLED1#2.3 457.96,189.03 ; 456.06,187.12 v4(440.31,187.12) 456.06,187.12
PA2: length 86.9
  Top Layer w0.3: 429.77,193.47 428.92,192.62 ; 429.77,193.47 429.77,207.82 ; 429.77,193.47 429.77,207.82 ; 429.77,193.47 428.92,192.62 ; 428.92,192.62 v4(414.78,192.62) 428.92,192.62 ; 431.55,209.6 429.77,207.82 ; 431.55,209.6 SPI#2.7 431.55,209.6 ; 431.55,209.6 429.77,207.82
  Bottom Layer w0.3: 410.72,192.08 411.27,192.62 ; 410.72,192.08 406.65,192.08 ; 410.72,192.08 411.27,192.62 ; 410.72,192.08 406.65,192.08 ; 411.27,192.62 v4(414.78,192.62) 411.27,192.62 ; 406.44,193.07 406.44,192.29 ; 406.44,193.07 J1#3.3 406.44,193.07 ; 406.44,193.07 406.44,192.29 ; 406.44,192.29 406.65,192.08 ; 406.44,192.29 406.65,192.08
PA8: length 71
  Top Layer w0.3: 400.05,197.54 402.59,195 ; 400.05,197.54 400.05,204.27 ; 400.05,197.54 400.05,204.27 ; 400.05,197.54 402.59,195 ; 402.59,195 402.59,178.71 ; 402.59,195 402.59,178.71 ; 400.05,204.27 398.56,205.75 ; 400.05,204.27 398.56,205.75 ; 402.59,178.71 403.35,177.95 ; 402.59,178.71 403.35,177.95 ; 403.35,177.95 J1#3.15 403.35,177.95 ; 398.56,205.75 蓝牙#2.4 398.56,205.75
PA9: length 79.8
  Top Layer w0.3: 403.35,180.01 404.11,179.25 ; 403.35,180.01 404.11,179.25 ; 403.35,180.01 403.35,196.14 ; 403.35,180.01 403.35,196.14 ; 404.11,179.25 407.8,179.25 ; 404.11,179.25 407.8,179.25 ; 400.94,206.81 400.94,198.55 ; 400.94,206.81 399.45,208.29 ; 400.94,206.81 400.94,198.55 ; 400.94,206.81 399.45,208.29 ; 400.94,198.55 403.35,196.14 ; 400.94,198.55 403.35,196.14 ; 399.45,208.29 蓝牙#2.3 399.45,208.29 ; 407.8,179.25 J1#3.16 407.8,179.25
PA10: length 44
  Bottom Layer w0.3: 401.7,163.88 K230#2.4 401.7,163.88 ; 401.7,163.88 402.08,164.26 ; 401.7,163.88 402.08,164.26 ; 402.08,164.26 402.08,173.66 ; 402.08,164.26 402.08,173.66 ; 402.08,173.66 403.83,175.41 ; 402.08,173.66 403.83,175.41 ; 403.83,175.41 J1#3.17 403.83,175.41
PA11: length 50.9
  Top Layer w0.3: 403.66,173.97 v4(403.48,173.79) 403.66,173.97 ; 403.66,173.97 407.66,173.97 ; 403.66,173.97 407.66,173.97 ; 407.66,173.97 J1#3.18 407.66,173.97
  Bottom Layer w0.3: 402.87,173.17 v4(403.48,173.79) 402.87,173.17 ; 402.87,173.17 402.87,164.03 ; 402.87,173.17 402.87,164.03 ; 402.87,164.03 401.96,163.12 ; 402.87,164.03 401.96,163.12 ; 396.62,163.12 401.96,163.12 ; 396.62,163.12 K230#2.3 396.62,163.12 ; 396.62,163.12 401.96,163.12
PA12: length 92.7
  Top Layer w0.3: 442.93,148.27 443.23,147.97 ; 442.93,148.27 420.49,148.27 ; 442.93,148.27 443.23,147.97 ; 442.93,148.27 420.49,148.27 ; 443.23,147.97 L298N2#2.3 443.23,147.97 ; 419.86,148.9 v4(419.86,151.44) 419.86,148.9 ; 419.86,148.9 420.49,148.27 ; 419.86,148.9 420.49,148.27
  Bottom Layer w0.3: 419.38,160.17 419.86,159.69 ; 419.38,160.17 419.86,159.69 ; 419.38,160.17 J1#3.30 419.38,160.17 ; 419.86,159.69 v4(419.86,151.44) 419.86,159.69
PA13: length 164.4
  Top Layer w0.3: 473.2,157.03 LED11#2.1 473.2,157.03 ; 473.2,157.03 SW5#2.2 473.2,157.03
  Inner2 w0.3: 420.88,148.64 419.48,150.04 ; 420.88,148.64 437.26,148.64 ; 420.88,148.64 419.48,150.04 ; 420.88,148.64 437.26,148.64 ; 419.48,150.04 416.94,150.04 ; 419.48,150.04 416.94,150.04 ; 437.26,148.64 437.9,149.28 ; 437.26,148.64 437.9,149.28 ; 464.82,150.17 463.93,149.28 ; 464.82,150.17 464.82,156.13 ; 464.82,150.17 463.93,149.28 ; 464.82,150.17 464.82,156.13 ; 463.93,149.28 437.9,149.28 ; 463.93,149.28 437.9,149.28 ; 464.82,156.13 467.49,158.8 ; 464.82,156.13 467.49,158.8 ; 467.49,158.8 SW5#2.2 467.49,158.8 ; 414.91,152.07 408.43,152.07 ; 414.91,152.07 416.94,150.04 ; 414.91,152.07 408.43,152.07 ; 414.91,152.07 416.94,150.04 ; 408.43,152.07 406.56,153.94 ; 408.43,152.07 406.56,153.94 ; 406.56,153.94 J1#3.31 406.56,153.94
PA14: length 188.9
  Top Layer w0.3: 478.79,158.55 LED12#2.1 478.79,158.55 ; 478.79,158.55 SW4#2.2 478.79,158.55
  Inner2 w0.3: 470.66,144.83 410.72,144.83 ; 470.66,144.83 476.38,150.55 ; 470.66,144.83 410.72,144.83 ; 470.66,144.83 476.38,150.55 ; 410.72,144.83 409.19,146.36 ; 410.72,144.83 409.19,146.36 ; 477.01,158.67 476.38,158.04 ; 477.01,158.67 476.38,158.04 ; 477.01,158.67 SW4#2.2 477.01,158.67 ; 476.38,158.04 476.38,150.55 ; 476.38,158.04 476.38,150.55 ; 409.19,146.36 v4(409.19,151.18) 409.19,146.36
  Bottom Layer w0.3: 409.19,157.54 v4(409.19,151.18) 409.19,157.54 ; 409.19,157.54 J1#3.32 409.19,157.54
PA15: length 46.9
  Top Layer w0.3: v4(445.52,153.98) v4(447.42,153.98) v4(445.52,153.98)
  Bottom Layer w0.3: 448.31,153.09 L298N2#2.1 448.31,153.09 ; 448.31,153.09 v4(447.42,153.98) 448.31,153.09 ; 434.37,154.83 J2#3.32 434.37,154.83 ; 434.37,154.83 435.23,153.98 ; 434.37,154.83 435.23,153.98 ; 435.23,153.98 v4(445.52,153.98) 435.23,153.98
PA16: length 107.5
  Top Layer w0.3: 397.33,165.45 W25Q16存储器.1 397.33,165.45 ; 397.33,165.45 398.91,163.88 ; 397.33,165.45 398.91,163.88 ; 398.91,163.88 v4(411.35,163.88) 398.91,163.88 ; 425.58,157.28 v4(425.58,159.82) 425.58,157.28 ; 425.58,157.28 v4(427.86,154.99) 425.58,157.28
  Bottom Layer w0.3: 425.58,160.58 v4(425.58,159.82) 425.58,160.58 ; 425.58,160.58 422.27,163.88 ; 425.58,160.58 422.27,163.88 ; 422.27,163.88 v4(411.35,163.88) 422.27,163.88 ; 431.16,154.74 431.83,155.41 ; 431.16,154.74 428.12,154.74 ; 431.16,154.74 428.12,154.74 ; 431.16,154.74 431.83,155.41 ; 431.83,155.41 J2#3.31 431.83,155.41 ; 428.12,154.74 v4(427.86,154.99) 428.12,154.74
